# Altium project DVT-SerialBuffer.PrjPcb
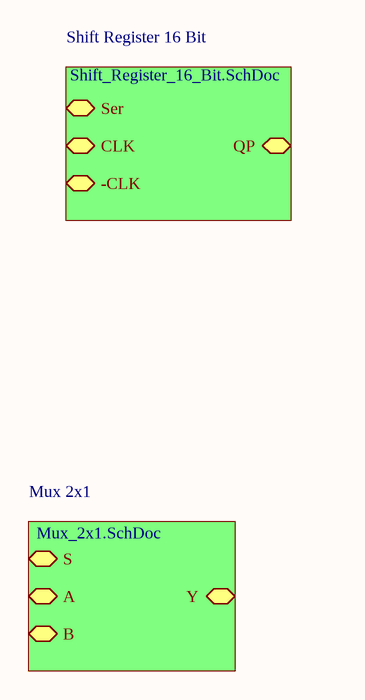
[diagram p0: DVT-SerialBuffer.SchDoc]
3 sheets, 3 parts. Net scope: hierarchical (ports join the sheet entries above them; power ports are global).
Sheets:
  DVT-SerialBuffer.SchDoc
    Mux 2x1 = Mux_2x1.SchDoc
    Shift Register 16 Bit = Shift_Register_16_Bit.SchDoc

## Sheet DVT-SerialBuffer.SchDoc: DVT Serial Buffer
size A4; PartNumber: PNxxx; Drawn By: Sebastian Kulik

### Sub-sheets
Mux 2x1 = Mux_2x1.SchDoc: S, A, B, Y
Shift Register 16 Bit = Shift_Register_16_Bit.SchDoc: Ser, CLK, -CLK, QP

### Notes on the sheet
- Title
- Date
- Part Number
- Revision
- Sheet
- of
- Drawn By
- File

## Sheet Mux_2x1.SchDoc: Mux 2x1
size A4; SheetNumber: 1; SheetTotal: 1; PartNumber: PNxxx; Drawn By: Sebastian Kulik
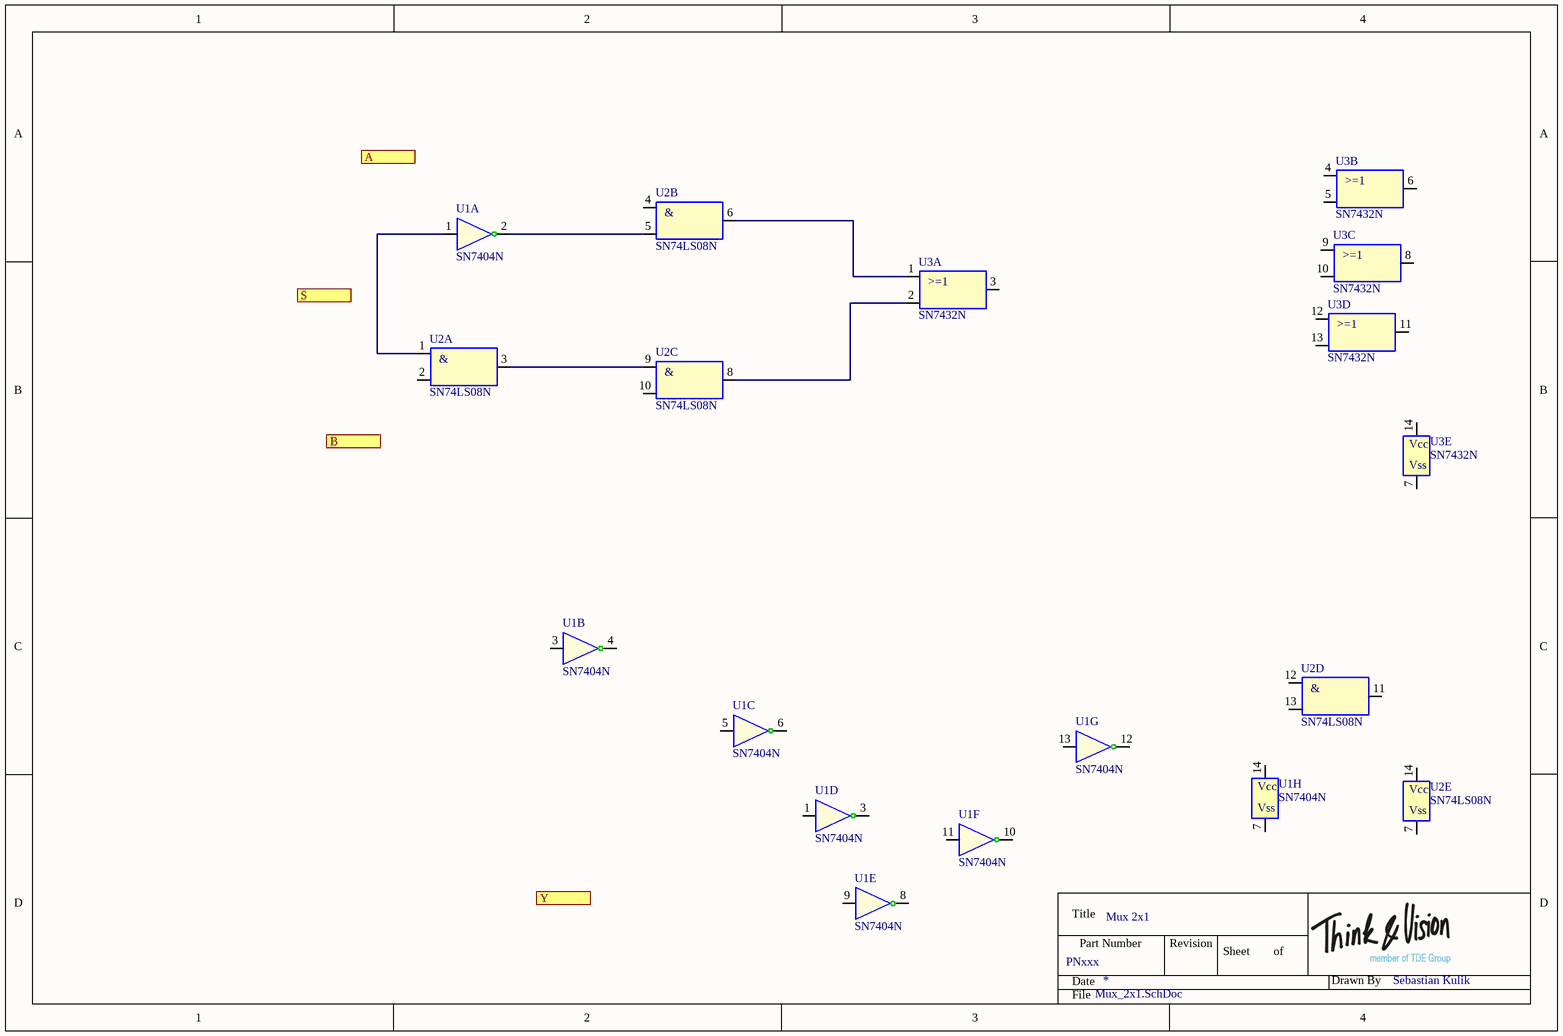
[diagram p1: Mux_2x1.SchDoc]

### Parts
U1  SN7404N  [DIP-14]  (parts A,B,C,D,E,F,G,H of 8)
U2  SN74LS08N  [DIP-14]  (parts A,B,C,D,E of 5)
U3  SN7432N  [DIP-14]  (parts A,B,C,D,E of 5)

### Ports
A, B, S, Y

### Nets
NetU1_1: U1.1(1A) U2.1(1A)
NetU1_2: U1.2(1Y) U2.5(2B)
NetU2_3: U2.3(Y1) U2.9(3A)
NetU2_6: U2.6(Y2) U3.1(1A)
NetU2_8: U2.8(Y3) U3.2(1B)

Not connected (* = marked no-connect by the designer): U1 3(2A) 4(2Y) 5(3A) 6(3Y) 7(Vss) 8(4Y) 9(4A) 10(5Y) 11(5A) 12(6Y) 13(6A) 14(Vcc); U2 2(1B) 4(2A) 7(Vss) 10(3B) 11(Y4) 12(4A) 13(4B) 14(Vcc); U3 3(Y1) 4(2A) 5(2B) 6(Y2) 7(Vss) 8(Y3) 9(3A) 10(3B) 11(Y4) 12(4A) 13(4B) 14(Vcc)

### Notes on the sheet
- Title
- Date
- Part Number
- Revision
- Sheet
- of
- Drawn By
- File
- (in symbol SN74LS08N, part A) &
- (in symbol SN74LS08N, part B) &
- (in symbol SN74LS08N, part C) &
- (in symbol SN74LS08N, part D) &
- (in symbol SN7432N, part A) >=1
- (in symbol SN7432N, part B) >=1
- (in symbol SN7432N, part C) >=1
- (in symbol SN7432N, part D) >=1

### Library data of the parts
U1 = SN7404N: Hex Inverter TTL; Deliverer PartNr: 305-529; Manufacturer: TI; Deliverer: RS; TDE-PN: IC0086; Published: 24.11.2016; PackageDescription: DIP14; Publisher: Sebastian Kulik; Manufacturer PartNr: SN7404N; Price: 1
U2 = SN74LS08N: Quad AND, TTL; Deliverer PartNr: 307-519; Manufacturer: TI; Deliverer: RS; TDE-PN: IC0088; Published: 24.11.2016; PackageDescription: DIP14; Publisher: Sebastian Kulik; Manufacturer PartNr: SN74LS08N; Price: 0.56
U3 = SN7432N: Quad NAND, TTL; Deliverer PartNr: 304-093; Manufacturer: TI; Deliverer: RS; TDE-PN: IC0087; Published: 24.11.2016; PackageDescription: DIP14; Publisher: Sebastian Kulik; Manufacturer PartNr: SN7432N; Price: 1.24

## Sheet Shift_Register_16_Bit.SchDoc: Shift Register 16 Bit
size A3; SheetNumber: 1; SheetTotal: 1; PartNumber: PNxxx; Drawn By: Sebastian Kulik
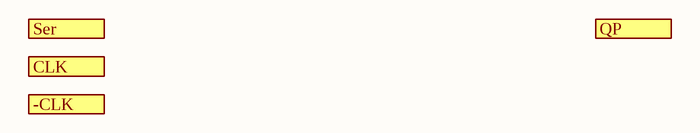
[diagram p2: Shift_Register_16_Bit.SchDoc]

### Ports
-CLK, CLK, QP, Ser

### Notes on the sheet
- Title
- Date
- Part Number
- Revision
- Sheet
- of
- Drawn By
- File